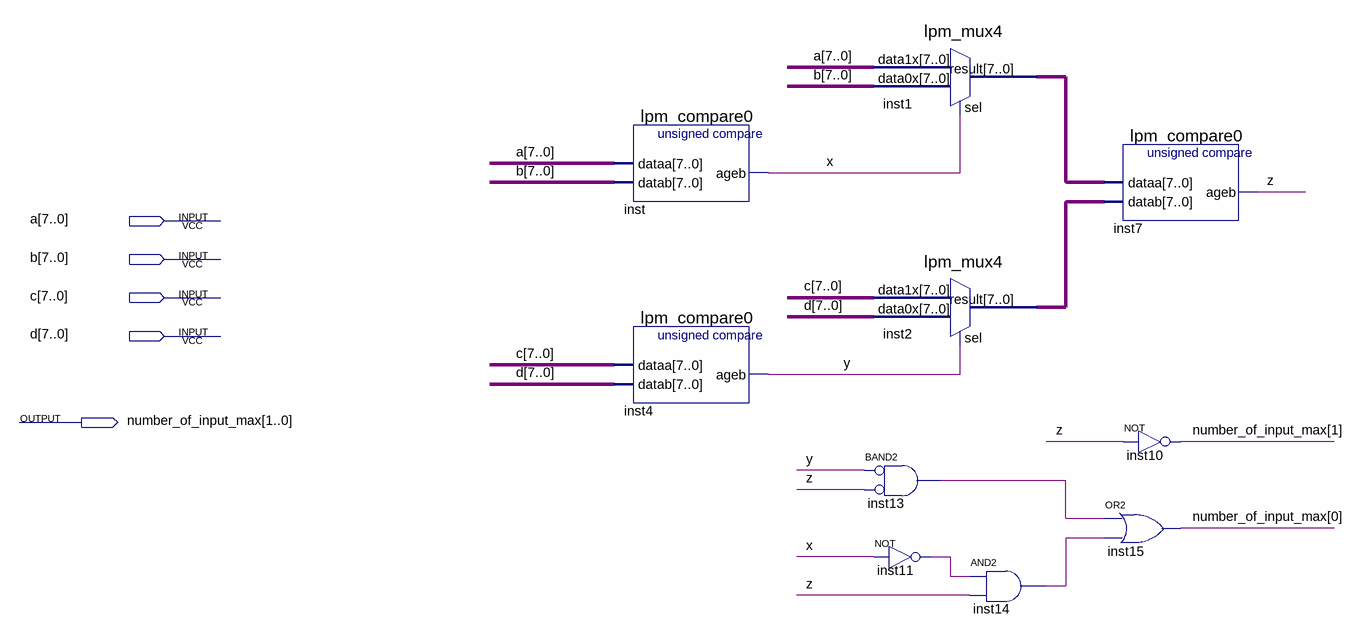
[diagram p0: schematic sheet]
// Quartus schematic ComparatorGetMax.bdf as structural Verilog: 10 symbols, 5 pins
module ComparatorGetMax (
  input  [7:0] a,
  input  [7:0] b,
  input  [7:0] c,
  input  [7:0] d,
  output [1:0] number_of_input_max
);

  wire inst11_out, inst13_out, inst14_out, x, y, z;
  wire [7:0] inst1_result, inst2_result;

  lpm_compare0 inst (.dataa(a), .datab(b), .ageb(x));
  lpm_compare0 inst4 (.dataa(c), .datab(d), .ageb(y));
  and inst13 (inst13_out, ~y, ~z);  // BAND2
  lpm_mux4 inst1 (.data1x(a), .data0x(b), .sel(x), .result(inst1_result));
  lpm_mux4 inst2 (.data1x(c), .data0x(d), .sel(y), .result(inst2_result));
  not inst11 (inst11_out, x);
  and inst14 (inst14_out, inst11_out, z);
  lpm_compare0 inst7 (.dataa(inst1_result), .datab(inst2_result), .ageb(z));
  not inst10 (number_of_input_max[1], z);
  or inst15 (number_of_input_max[0], inst13_out, inst14_out);
endmodule
